# EAGLE design MRCS-RING_GENERATOR-BREAKOUT (EAGLE 7.7.0)
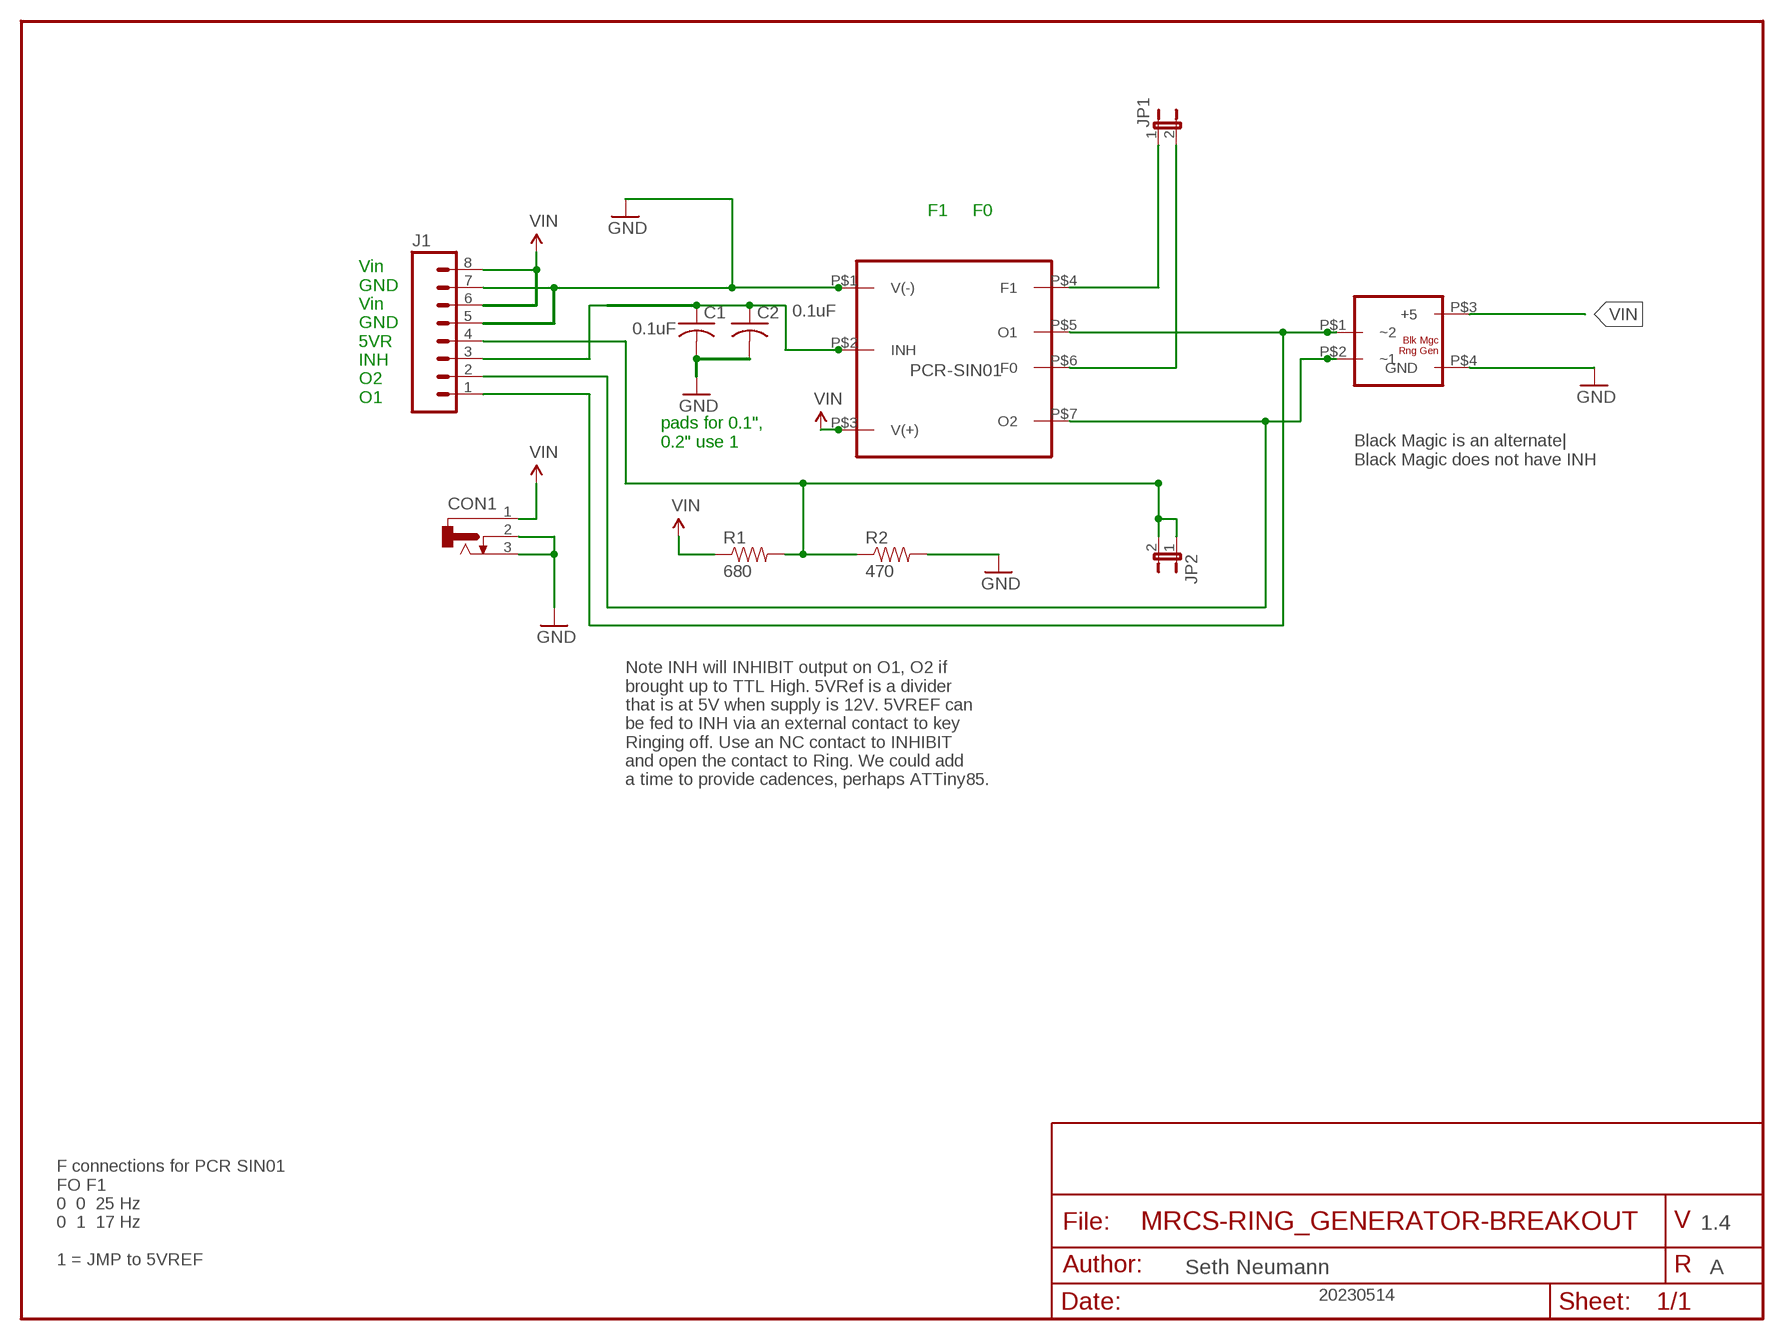
[diagram p0: schematic, sheet 1]

## Parts
C1  0.1uF  CAPPTH1  [C050-024X044]
C2  0.1uF  CAPPTH2  [C-PTH-0.100]
CON1  CONNECTOR-DC-POWER-RA  [DCJ0202]
J1  CONNECTOR-M08LOCK  [1X08_LOCK]
JP1  JUMPER-2PTH_LOCK  [1X02_LOCK]
JP2  JUMPER-2PTH_LOCK  [1X02_LOCK]
R1  680  RPTH04  [AXIAL-0.4-RES]
R2  470  RPTH04  [AXIAL-0.4-RES]
U$1  PCR-SIN01  [PCR-SIN01]
U$5  BLACK_MAGIC_RING_GEN  [BLACK_MAGIC_RING_GEN]

## Nets
5VREF: J1.4 JP2.1 JP2.2 R1.P$2 R2.P$1
F0: JP1.2 U$1.P$6(F0)
F1: JP1.1 U$1.P$4(F1)
GND: C1.2 C2.2 CON1.2 CON1.3 J1.5 J1.7 R2.P$2 U$1.P$1(V(-)) U$5.P$4(GND)
INH: C1.1 C2.1 J1.3 U$1.P$2(INH)
O1: J1.1 U$1.P$5(O1) U$5.P$1(~2)
O2: J1.2 U$1.P$7(O2) U$5.P$2(~1)
VIN: CON1.1 J1.6 J1.8 R1.P$1 U$1.P$3(V(+)) U$5.P$3(+5)

## Notes on the sheet
- F1     F0
- Vin
  GND
  Vin
  GND
  5VR
  INH
  O2
  O1
- pads for 0.1", 
  0.2" use 1
- Black Magic is an alternate|
  Black Magic does not have INH
- Note INH will INHIBIT output on O1, O2 if
  brought up to TTL High. 5VRef is a divider
  that is at 5V when supply is 12V. 5VREF can
  be fed to INH via an external contact to key
  Ringing off. Use an NC contact to INHIBIT
  and open the contact to Ring. We could add
  a time to provide cadences, perhaps ATTiny85.
- 1.4
- F connections for PCR SIN01
  FO F1
  0  0  25 Hz 
  0  1  17 Hz
  
  1 = JMP to 5VREF
- Seth Neumann | A
- 20230514

## Library data of the parts
C1 C2 = SPCoast:CAP*
CON1 = SPCoast:CONNECTOR-DC-POWER: DC POWER JACK
J1 = SPCoast:CONNECTOR-M08: Header 8 Standard 8-pin 0.1" header. Use with straight break away headers (SKU : PRT-00116), right angle break away headers (PRT-00553), swiss pins (PRT-00743), machine pins (PRT-00117), and female headers (PRT-00115).
JP1 JP2 = SPCoast:JUMPER-2: Jumper Basic 0.1" spaced jumper. Use with breakaway headers.
R1 R2 = SPCoast:R*: Resistor Basic schematic elements and footprints for 0603, 1206, and PTH 1/10th watt (small) resistors.
U$1 = MRCS:PCR-SIN01: PCR SIN01 Ring Module
U$5 = MRCS:BLACK_MAGIC_RING_GEN: Black Magic 5V Ring Generator

## Board
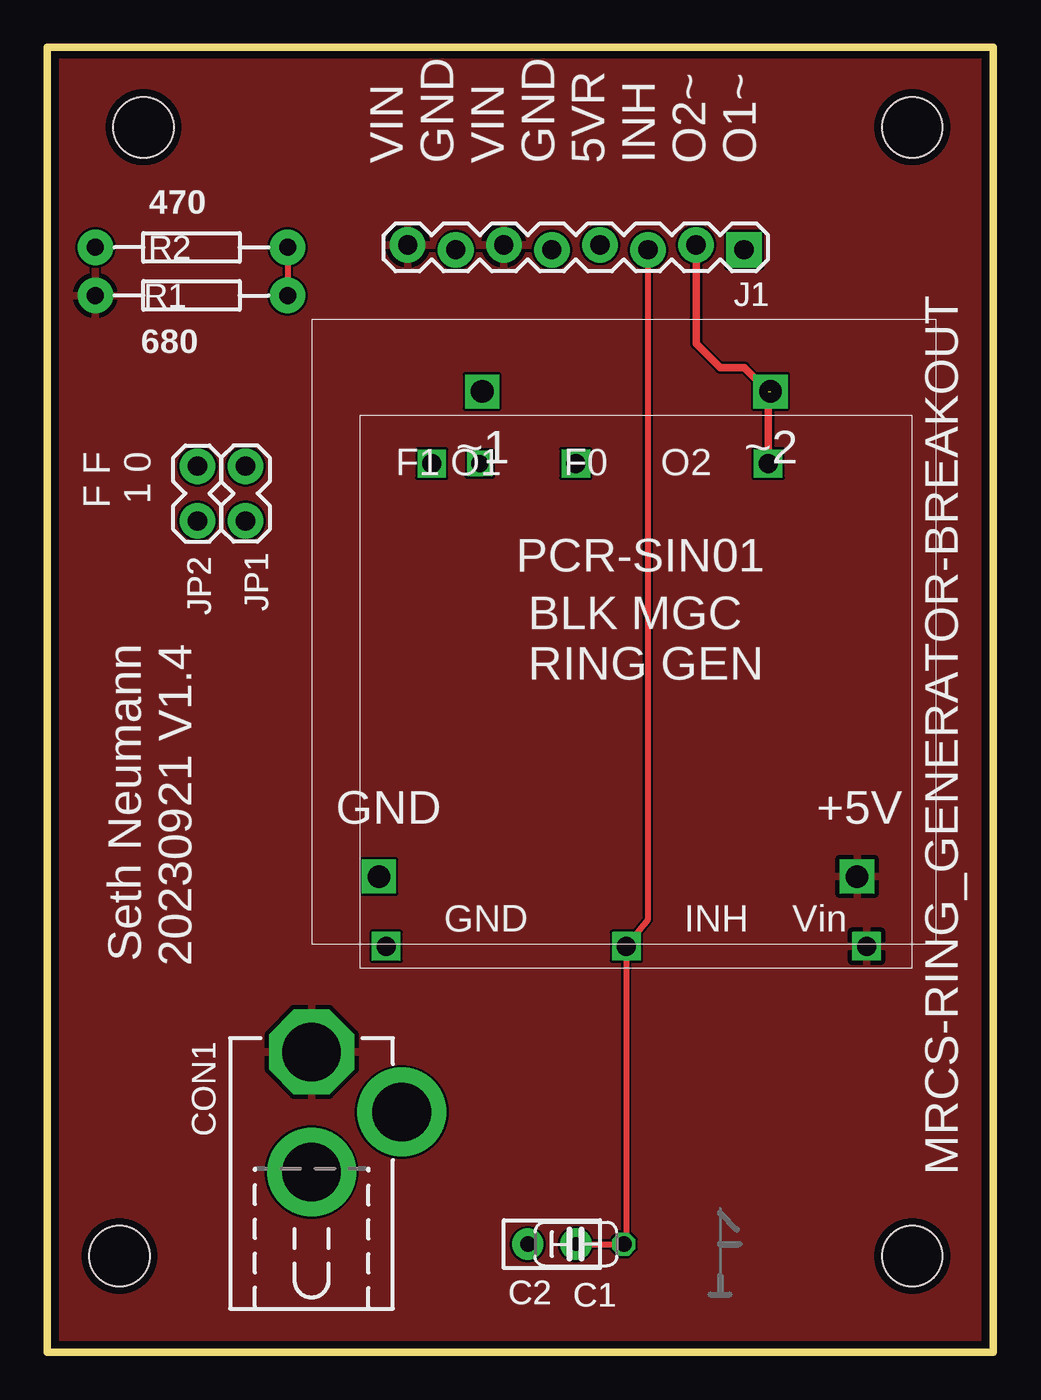
[diagram p1: board, top side]
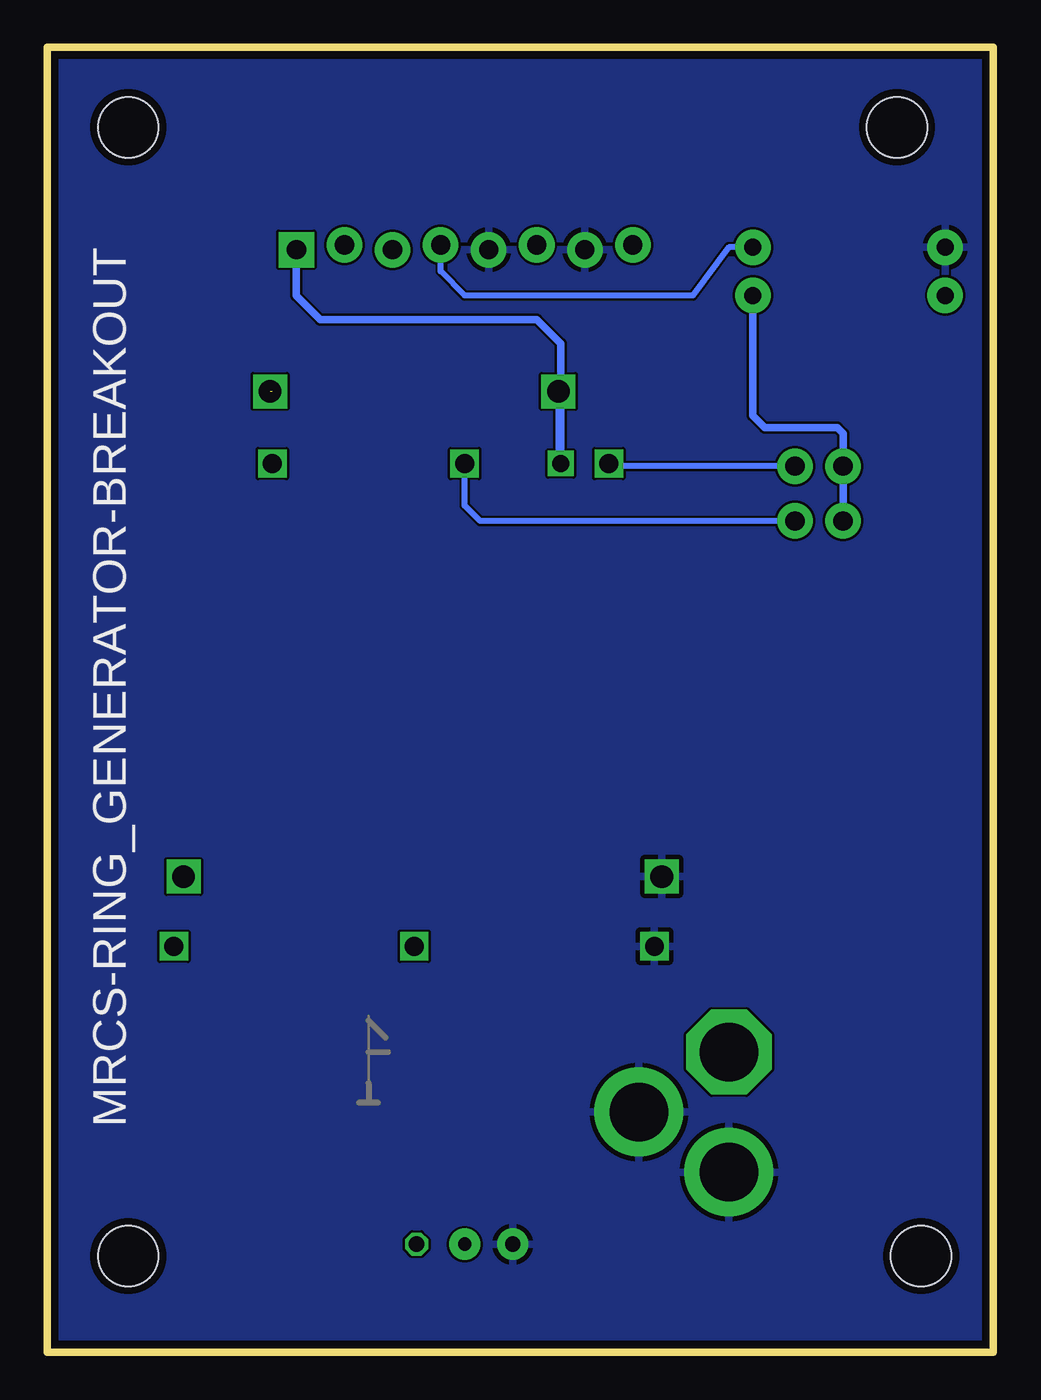
[diagram p2: board, bottom side, seen from below]

Size 50 x 69 mm. Coordinates in mm from the lower left corner, seen from the top.
Outline: 0,0 50,0 50,69 0,69 0,0
Copper layers (1*16): Top 0.035mm / dielectric 1.5mm / Bottom 0.035mm
Design rules "default *": minimum track width 5mil, minimum drill 0.2mm, track to track 5mil, track to pad 5mil, pad to pad 5mil, via to via 5mil, smd to smd 5mil, copper to edge 0.4mm, drill to drill 5mil, minimum pad ring 3mil, minimum via ring 3mil, stop-mask expansion 4mil, vias tented up to drill 0mil, thermal gap 10mil
Holes 3.2 mm at 45.72,64.77 3.81,5.08 45.72,5.08 5.08,64.77

### Footprints (pad centres in the part's own frame; a part is rotated, then mirrored left to right if it is on the bottom)
C050-024X044 = drill 0.813 octagon: 1 -2.54,0; 2 2.54,0
C-PTH-0.100 = drill 0.7 pad 1.651: 1 -1.27,0; 2 1.27,0
DCJ0202 = drill 3.1 pad 4.5 octagon: 1 0,3.175 | drill 3.1 pad 4.7: 2 4.763,0; 3 0,-3.175
1X08_LOCK = drill 1.016 pad 1.88 square: 1 0,0.127 | drill 1.016 pad 1.88: 2 2.54,-0.127; 3 5.08,0.127; 4 7.62,-0.127; 5 10.16,0.127; 6 12.7,-0.127; 7 15.24,0.127; 8 17.78,-0.127
1X02_LOCK = drill 1.016 pad 1.88: 1 -0.178,0; 2 2.718,0
AXIAL-0.4-RES = drill 0.9 pad 1.88: P$1 -5.08,0; P$2 5.08,0
PCR-SIN01 = drill 1 square: P$1 1.143,27.813; P$2 1.143,15.113; P$3 1.143,2.413; P$4 26.67,25.4; P$6 26.67,17.78; P$7 26.67,7.62 | drill 0.9 square: P$5 26.67,22.86
BLACK_MAGIC_RING_GEN = drill 1.2 square: P$1 9.017,29.21; P$2 24.257,29.21; P$3 28.829,3.556; P$4 3.556,3.556

### Placement (x,y rotation side)
C1  27.94,5.71 180 top
C2  26.67,5.71 180 top
CON1  13.97,12.7 0 top
J1  36.83,58.42 180 top
JP1  10.48,46.67 270 top
JP2  7.94,44.13 90 top
R1  7.62,55.88 0 top
R2  7.62,58.42 180 top
U$1  45.72,20.32 90 top
U$2  [MRCSLOGOTOP]  34.29,2.54 0 top
U$3  [CA-PROP65WARNING]  25.4,35.56 0 top
U$4  [MRCSLOGOBTM]  26.67,12.7 0 top
U$5  13.97,21.59 0 top

### Tracks (layer width: path | path; a pad name or v marks a point on that pad's centre or on a via)
5VREF
  Top 0.305: R2.P$1 R1.P$2
  Bottom 0.305: R2.P$1 13.97,58.42 15.88,55.88 27.94,55.88 29.21,57.15 J1.4
  Bottom 0.406: JP2.1 JP2.2 7.94,48.58 8.26,48.9 12.06,48.9 12.7,49.53 R1.P$2
F0
  Bottom 0.305: JP1.2 27.13,43.95 27.94,44.77 U$1.P$6
F1
  Bottom 0.305: JP1.1 20.18,46.85 U$1.P$4
GND
  pour Bottom: 0,0 49.53,0 49.53,68.58 0,68.58
INH
  Top 0.305: J1.3 31.75,22.86 U$1.P$2 30.61,5.84 C1.1 C2.1
O1
  Bottom 0.305: U$5.P$1 22.99,47.12 U$1.P$5
  Bottom 0.406: U$1.P$5 22.86,53.34 24.13,54.61 35.56,54.61 36.83,55.88 J1.1
O2  (1 unrouted)
  Top 0.406: J1.2 34.29,53.34 35.56,52.07 36.83,52.07 38.1,50.8 U$1.P$7
VIN
  pour Top: 0,0 49.53,0 50.16,68.58 0,68.58

### Text on the board
tPlace: VIN / GND / VIN / GND / 5VR / INH / O2~ / O1~ | F F / 1 0 | F1 O1 | F0 O2 | PCR-SIN01 | Seth Neumann / 20230921 V1.4 | GND | INH | Vin
_tNames: R2 | R2 | J1 | J1 | R1 | R1 | JP1 | JP1 | JP2 | JP2 | CON1 | CON1 | C2 | C2 | C1 | C1